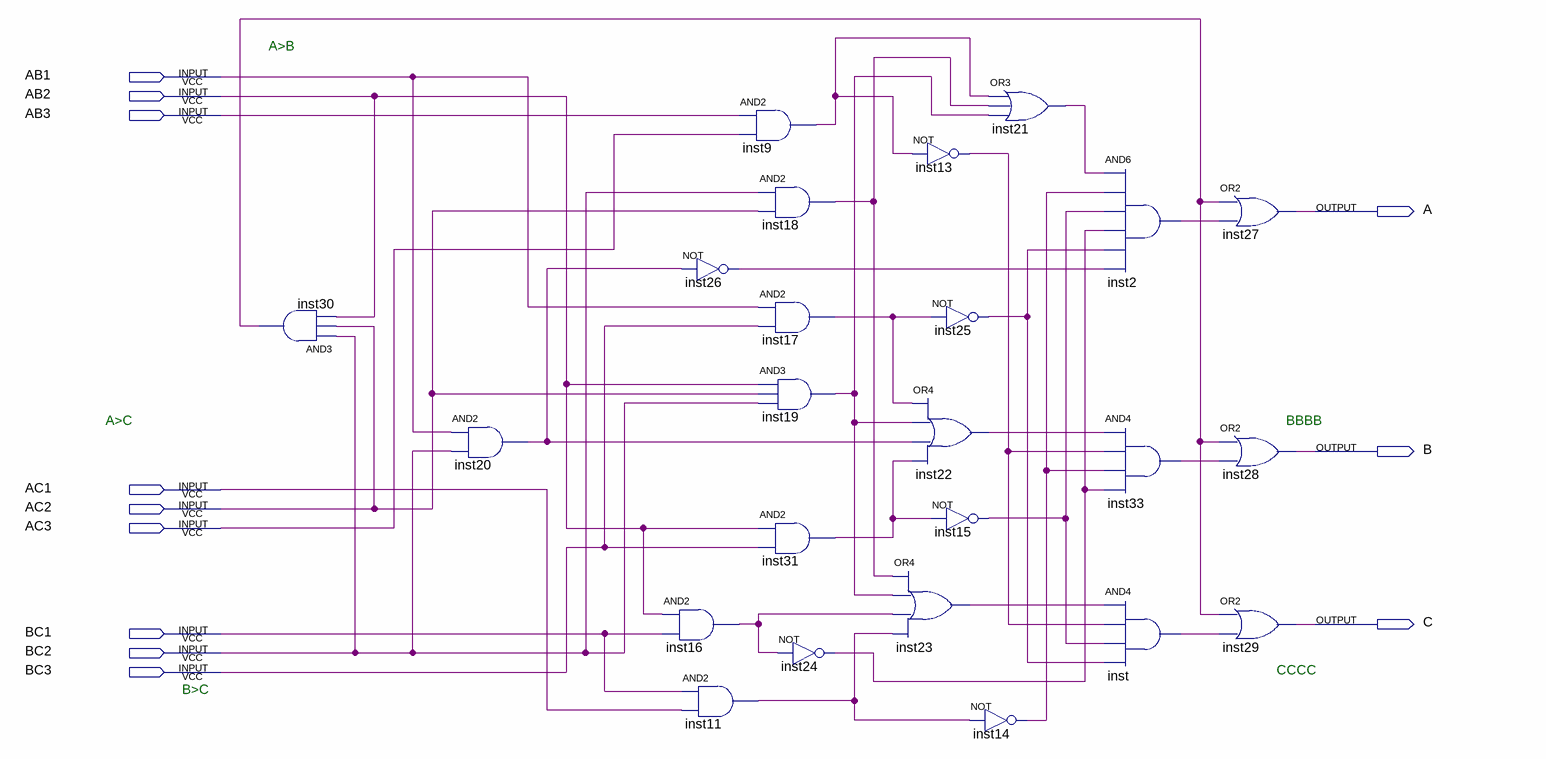
[diagram p0: schematic sheet]
// Quartus schematic Decoders - Copia.bdf as structural Verilog: 24 symbols, 12 pins
module \Decoders_-_Copia  (
  input  AB1,
  input  AB2,
  input  AB3,
  input  AC1,
  input  AC2,
  input  AC3,
  input  BC1,
  input  BC2,
  input  BC3,
  output A,
  output B,
  output C
);

  wire inst2_out, inst9_out, inst11_out, inst13_out, inst14_out, inst15_out, inst16_out, inst17_out,
       inst18_out, inst19_out, inst20_out, inst21_out, inst22_out, inst23_out, inst24_out, inst25_out,
       inst26_out, inst30_out, inst31_out, inst33_out, inst_out;

  and inst30 (inst30_out, BC2, AC2, AB2);
  and inst20 (inst20_out, AB1, BC2);
  not inst26 (inst26_out, inst20_out);
  and inst16 (inst16_out, AB2, BC1);
  and inst11 (inst11_out, BC1, AC1);
  and inst9 (inst9_out, AB3, AC3);
  and inst18 (inst18_out, BC2, AC2);
  and inst17 (inst17_out, AB1, BC3);
  and inst19 (inst19_out, AB2, AC2, BC2);
  and inst31 (inst31_out, AB2, BC3);
  not inst24 (inst24_out, inst16_out);
  not inst13 (inst13_out, inst9_out);
  not inst25 (inst25_out, inst17_out);
  or inst22 (inst22_out, inst17_out, inst19_out, inst20_out, inst31_out);
  not inst15 (inst15_out, inst31_out);
  or inst23 (inst23_out, inst18_out, inst19_out, inst16_out, inst11_out);
  or inst21 (inst21_out, inst9_out, inst18_out, inst19_out);
  not inst14 (inst14_out, inst11_out);
  and inst2 (inst2_out, inst21_out, inst14_out, inst15_out, inst24_out, inst25_out, inst26_out);
  and inst33 (inst33_out, inst22_out, inst13_out, inst14_out, inst24_out);
  and inst (inst_out, inst23_out, inst13_out, inst15_out, inst25_out);
  or inst27 (A, inst30_out, inst2_out);
  or inst28 (B, inst30_out, inst33_out);
  or inst29 (C, inst30_out, inst_out);

  // Notes on the sheet:
  //   A>B
  //   A>C
  //   BBBB
  //   CCCC
  //   B>C
endmodule
